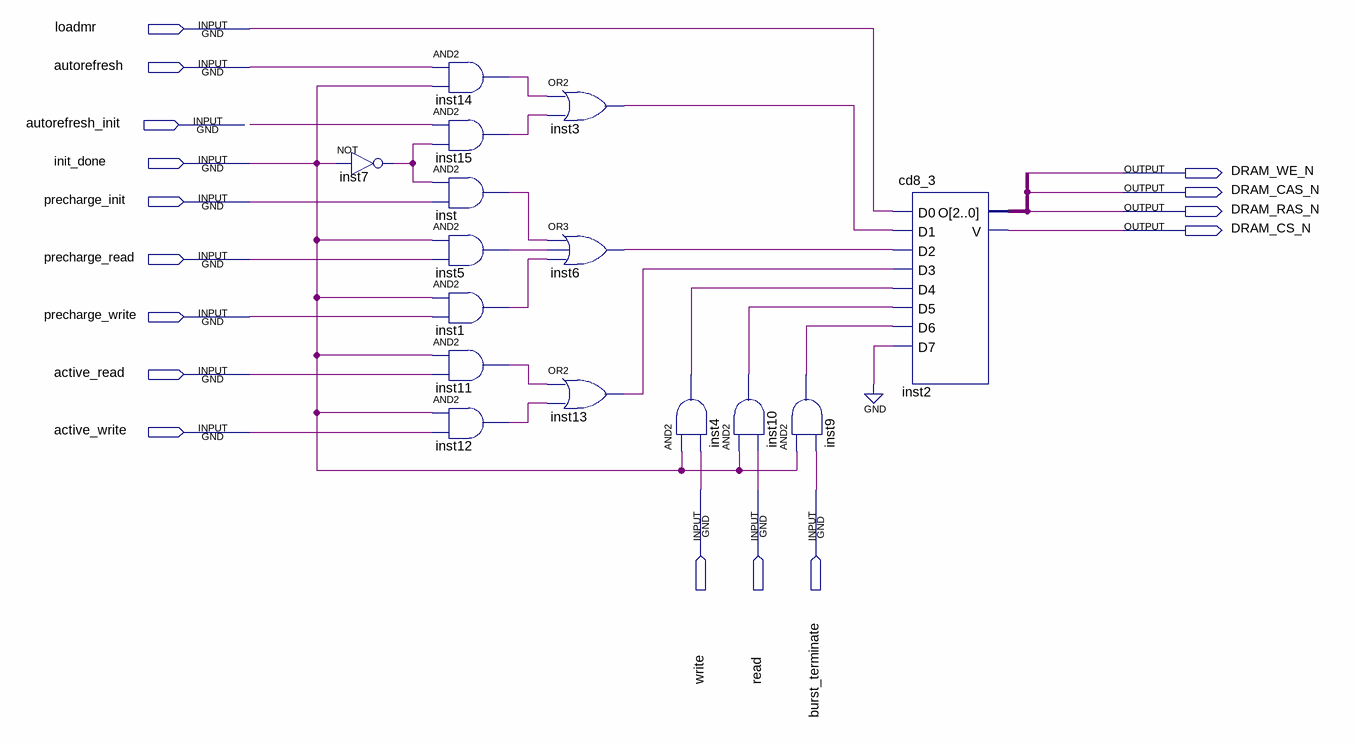
[diagram p0: schematic sheet]
// Quartus schematic dram_inst_dc.bdf as structural Verilog: 15 symbols, 16 pins
module dram_inst_dc (
  input  loadmr,
  input  autorefresh,
  input  autorefresh_init,
  input  init_done,
  input  precharge_init,
  input  precharge_read,
  input  precharge_write,
  input  active_read,
  input  active_write,
  input  write,
  input  read,
  input  burst_terminate,
  output DRAM_WE_N,
  output DRAM_CAS_N,
  output DRAM_RAS_N,
  output DRAM_CS_N
);

  wire inst1_out, inst3_out, inst4_out, inst5_out, inst6_out, inst7_out, inst9_out, inst10_out, inst11_out,
       inst12_out, inst13_out, inst14_out, inst15_out, inst_out;

  not inst7 (inst7_out, init_done);
  and inst14 (inst14_out, autorefresh, init_done);
  and inst15 (inst15_out, autorefresh_init, inst7_out);
  and inst (inst_out, inst7_out, precharge_init);
  and inst5 (inst5_out, init_done, precharge_read);
  and inst1 (inst1_out, init_done, precharge_write);
  and inst11 (inst11_out, init_done, active_read);
  and inst12 (inst12_out, init_done, active_write);
  or inst3 (inst3_out, inst14_out, inst15_out);
  or inst6 (inst6_out, inst_out, inst5_out, inst1_out);
  or inst13 (inst13_out, inst11_out, inst12_out);
  and inst4 (inst4_out, init_done, write);
  and inst10 (inst10_out, init_done, read);
  and inst9 (inst9_out, init_done, burst_terminate);
  cd8_3 inst2 (
    .D0(loadmr), .D1(inst3_out), .D2(inst6_out), .D3(inst13_out), .D4(inst4_out), .D5(inst10_out),
    .D6(inst9_out), .D7(1'b0), .V(DRAM_CS_N), .O({DRAM_RAS_N, DRAM_CAS_N, DRAM_WE_N}));

  // Other names for the same wires on the sheet: DRAM_CAS = DRAM_CAS_N; DRAM_RAS = DRAM_RAS_N; DRAM_WE = DRAM_WE_N
endmodule
